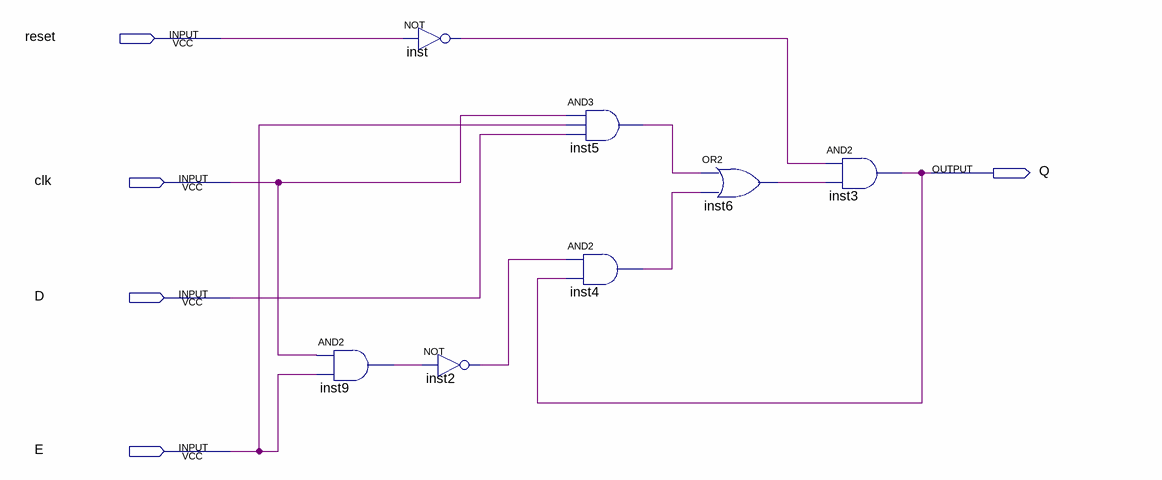
[diagram p0: schematic sheet]
// Quartus schematic DESwitch.bdf as structural Verilog: 7 symbols, 5 pins
module DESwitch (
  input  reset,
  input  clk,
  input  D,
  input  E,
  output Q
);

  wire inst2_out, inst4_out, inst5_out, inst6_out, inst9_out, inst_out;

  and inst9 (inst9_out, clk, E);
  not inst (inst_out, reset);
  not inst2 (inst2_out, inst9_out);
  and inst5 (inst5_out, clk, E, D);
  and inst4 (inst4_out, inst2_out, Q);
  or inst6 (inst6_out, inst5_out, inst4_out);
  and inst3 (Q, inst_out, inst6_out);
endmodule
